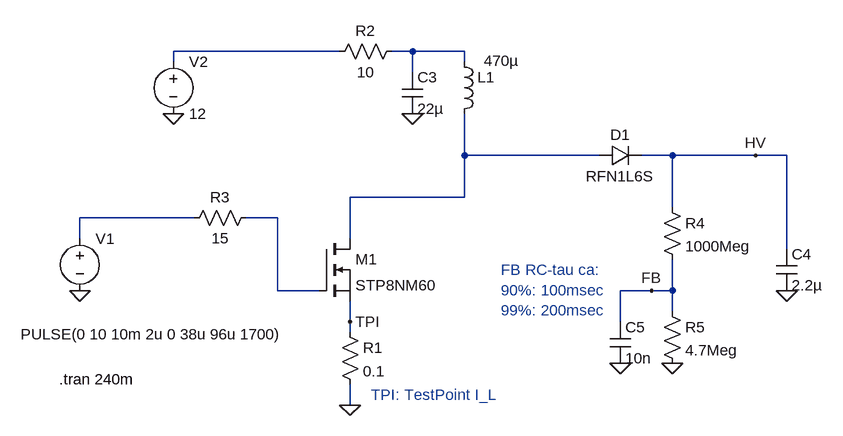
[diagram p0: schematic stepper1.asc]
stepper1.asc, the LTspice schematic file:
Version 4
SHEET 1 1880 680
WIRE 400 -112 144 -112
WIRE 512 -112 480 -112
WIRE 592 -112 512 -112
WIRE 144 -96 144 -112
WIRE 592 -96 592 -112
WIRE 512 -80 512 -112
WIRE 592 48 592 -16
WIRE 800 48 592 48
WIRE 912 48 864 48
WIRE 1040 48 912 48
WIRE 1088 48 1040 48
WIRE 592 112 592 48
WIRE 592 112 416 112
WIRE 912 128 912 48
WIRE 176 144 0 144
WIRE 304 144 256 144
WIRE 0 176 0 144
WIRE 416 176 416 112
WIRE 1088 192 1088 48
WIRE 304 256 304 144
WIRE 368 256 304 256
WIRE 880 256 832 256
WIRE 912 256 912 208
WIRE 912 256 880 256
WIRE 912 288 912 256
WIRE 416 304 416 272
WIRE 832 304 832 256
WIRE 416 320 416 304
WIRE 416 432 416 400
FLAG 0 256 0
FLAG 144 -16 0
FLAG 832 368 0
FLAG 912 368 0
FLAG 1088 256 0
FLAG 512 -16 0
FLAG 1040 48 HV
FLAG 880 256 FB
FLAG 416 432 0
FLAG 416 304 TPI
SYMBOL voltage 0 160 R0
WINDOW 3 -91 163 Left 2
WINDOW 123 0 0 Left 0
WINDOW 39 0 0 Left 0
SYMATTR Value PULSE(0 10 10m 2u 0 38u 96u 1700)
SYMATTR InstName V1
SYMBOL voltage 144 -112 R0
WINDOW 123 0 0 Left 0
WINDOW 39 0 0 Left 0
SYMATTR InstName V2
SYMATTR Value 12
SYMBOL res 496 -128 R90
WINDOW 0 0 56 VBottom 2
WINDOW 3 32 56 VTop 2
SYMATTR InstName R2
SYMATTR Value 10
SYMBOL res 272 128 R90
WINDOW 0 0 56 VBottom 2
WINDOW 3 32 56 VTop 2
SYMATTR InstName R3
SYMATTR Value 15
SYMBOL res 896 112 R0
SYMATTR InstName R4
SYMATTR Value 1000Meg
SYMBOL res 896 272 R0
SYMATTR InstName R5
SYMATTR Value 4.7Meg
SYMBOL cap 816 304 R0
SYMATTR InstName C5
SYMATTR Value 10n
SYMBOL cap 496 -80 R0
SYMATTR InstName C3
SYMATTR Value 22µ
SYMBOL ind 576 -112 R0
WINDOW 3 46 14 Left 2
SYMATTR Value 470µ
SYMATTR InstName L1
SYMATTR SpiceLine Rser=2
SYMBOL diode 800 64 R270
WINDOW 0 32 32 VTop 2
WINDOW 3 0 32 VBottom 2
SYMATTR InstName D1
SYMATTR Value RFN1L6S
SYMBOL cap 1072 192 R0
SYMATTR InstName C4
SYMATTR Value 2.2µ
SYMATTR SpiceLine V=1000 Rser=5
SYMBOL nmos 368 176 R0
SYMATTR InstName M1
SYMATTR Value STP8NM60
SYMBOL res 400 304 R0
SYMATTR InstName R1
SYMATTR Value 0.1
TEXT -32 392 Left 2 !.tran 240m
TEXT 648 224 Left 2 ;FB RC-tau ca:\n90%: 100msec\n99%: 200msec
TEXT 448 416 Left 2 ;TPI: TestPoint I_L

The netlist it stands for:
* stepper1.asc
V1 N004 0 PULSE(0 10 10m 2u 0 38u 96u 1700)
V2 N001 0 12
R2 N002 N001 10
R3 N005 N004 15
R4 HV FB 1000Meg
R5 FB 0 4.7Meg
C5 FB 0 10n
C3 N002 0 22µ
L1 N002 N003 470µ Rser=2
D1 N003 HV RFN1L6S
C4 HV 0 2.2µ V=1000 Rser=5
M1 N003 N005 TPI TPI STP8NM60
R1 TPI 0 0.1
.model D D
.lib standard.dio
.model NMOS NMOS
.model PMOS PMOS
.lib standard.mos
.tran 240m
* FB RC-tau ca:
* 90%: 100msec
* 99%: 200msec
* TPI: TestPoint I_L
.backanno
.end